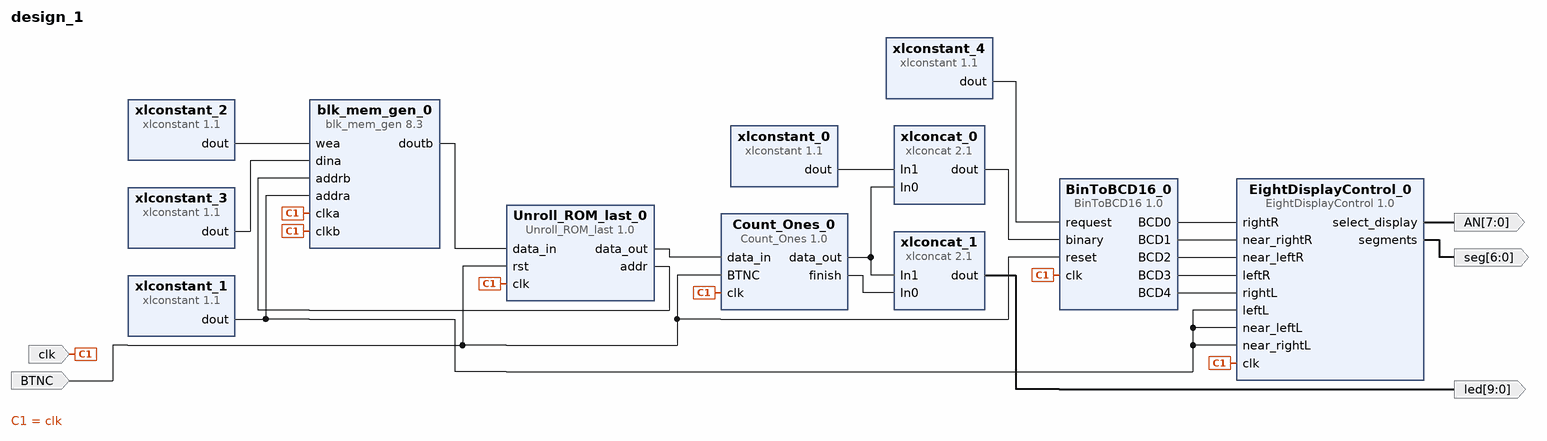
[diagram p0: block diagram of the top level]
# Vivado block design design_1, xc7a100tcsg324-1, Vivado 2016.4
create_bd_design design_1

create_bd_port -dir I clk
create_bd_port -dir O -from 7 -to 0 AN
create_bd_port -dir O -from 6 -to 0 seg
create_bd_port -dir I BTNC
create_bd_port -dir O -from 9 -to 0 led

create_bd_cell -type ip -vlnv xilinx.com:ip:blk_mem_gen:8.3 blk_mem_gen_0
set_property -dict [list \
  CONFIG.Memory_Type Simple_Dual_Port_RAM \
  CONFIG.Enable_32bit_Address false \
  CONFIG.Use_Byte_Write_Enable false \
  CONFIG.Write_Width_A 16 \
  CONFIG.Operating_Mode_A NO_CHANGE \
  CONFIG.Enable_A Always_Enabled \
  CONFIG.Write_Width_B 16 \
  CONFIG.Read_Width_B 16 \
  CONFIG.Enable_B Always_Enabled \
  CONFIG.Register_PortB_Output_of_Memory_Primitives false \
  CONFIG.Load_Init_File true \
  CONFIG.Coe_File 8ones.coe \
  CONFIG.Fill_Remaining_Memory_Locations false \
  CONFIG.Port_B_Clock 100 \
  CONFIG.Port_B_Enable_Rate 100 \
  CONFIG.use_bram_block Stand_Alone \
] [get_bd_cells blk_mem_gen_0]
create_bd_cell -type ip -vlnv user.org:user:BinToBCD16:1.0 BinToBCD16_0
create_bd_cell -type ip -vlnv xilinx.com:ip:xlconcat:2.1 xlconcat_0
set_property -dict {CONFIG.IN0_WIDTH 9 CONFIG.IN1_WIDTH 7} [get_bd_cells xlconcat_0]
create_bd_cell -type ip -vlnv xilinx.com:ip:xlconstant:1.1 xlconstant_0
set_property -dict {CONFIG.CONST_WIDTH 7 CONFIG.CONST_VAL 0} [get_bd_cells xlconstant_0]
create_bd_cell -type ip -vlnv user.org:user:EightDisplayControl:1.0 EightDisplayControl_0
create_bd_cell -type ip -vlnv xilinx.com:ip:xlconstant:1.1 xlconstant_1
set_property -dict {CONFIG.CONST_WIDTH 4 CONFIG.CONST_VAL 0} [get_bd_cells xlconstant_1]
create_bd_cell -type ip -vlnv xilinx.com:ip:xlconstant:1.1 xlconstant_2
set_property -dict {CONFIG.CONST_VAL 0} [get_bd_cells xlconstant_2]
create_bd_cell -type ip -vlnv xilinx.com:ip:xlconstant:1.1 xlconstant_3
set_property -dict {CONFIG.CONST_WIDTH 16 CONFIG.CONST_VAL 0} [get_bd_cells xlconstant_3]
create_bd_cell -type ip -vlnv xilinx.com:ip:xlconstant:1.1 xlconstant_4
create_bd_cell -type ip -vlnv user.org:user:Count_Ones:1.0 Count_Ones_0
set_property -dict {CONFIG.number_of_bits 256} [get_bd_cells Count_Ones_0]
create_bd_cell -type ip -vlnv xilinx.com:ip:xlconcat:2.1 xlconcat_1
set_property -dict {CONFIG.IN0_WIDTH 1 CONFIG.IN1_WIDTH 9} [get_bd_cells xlconcat_1]
create_bd_cell -type ip -vlnv user.org:user:Unroll_ROM_last:1.0 Unroll_ROM_last_0
set_property -dict {CONFIG.data_width 16} [get_bd_cells Unroll_ROM_last_0]

# ---- connections ----

connect_bd_net [get_bd_ports clk] \
  [get_bd_pins blk_mem_gen_0/clka] [get_bd_pins blk_mem_gen_0/clkb] [get_bd_pins BinToBCD16_0/clk] \
  [get_bd_pins EightDisplayControl_0/clk] [get_bd_pins Count_Ones_0/clk] [get_bd_pins Unroll_ROM_last_0/clk]
connect_bd_net [get_bd_pins Unroll_ROM_last_0/addr] [get_bd_pins blk_mem_gen_0/addrb]
connect_bd_net [get_bd_pins blk_mem_gen_0/doutb] [get_bd_pins Unroll_ROM_last_0/data_in]
connect_bd_net [get_bd_pins xlconstant_0/dout] [get_bd_pins xlconcat_0/In1]
connect_bd_net [get_bd_pins xlconcat_0/dout] [get_bd_pins BinToBCD16_0/binary]
connect_bd_net [get_bd_pins BinToBCD16_0/BCD0] [get_bd_pins EightDisplayControl_0/rightR]
connect_bd_net [get_bd_pins BinToBCD16_0/BCD1] [get_bd_pins EightDisplayControl_0/near_rightR]
connect_bd_net [get_bd_pins BinToBCD16_0/BCD2] [get_bd_pins EightDisplayControl_0/near_leftR]
connect_bd_net [get_bd_pins BinToBCD16_0/BCD3] [get_bd_pins EightDisplayControl_0/leftR]
connect_bd_net [get_bd_pins BinToBCD16_0/BCD4] [get_bd_pins EightDisplayControl_0/rightL]
connect_bd_net [get_bd_pins xlconstant_1/dout] \
  [get_bd_pins EightDisplayControl_0/near_rightL] [get_bd_pins EightDisplayControl_0/near_leftL] \
  [get_bd_pins EightDisplayControl_0/leftL] [get_bd_pins blk_mem_gen_0/addra]
connect_bd_net [get_bd_pins EightDisplayControl_0/select_display] [get_bd_ports AN]
connect_bd_net [get_bd_pins EightDisplayControl_0/segments] [get_bd_ports seg]
connect_bd_net [get_bd_pins xlconstant_2/dout] [get_bd_pins blk_mem_gen_0/wea]
connect_bd_net [get_bd_pins xlconstant_3/dout] [get_bd_pins blk_mem_gen_0/dina]
connect_bd_net [get_bd_pins xlconstant_4/dout] [get_bd_pins BinToBCD16_0/request]
connect_bd_net [get_bd_ports BTNC] [get_bd_pins BinToBCD16_0/reset] [get_bd_pins Count_Ones_0/BTNC] [get_bd_pins Unroll_ROM_last_0/rst]
connect_bd_net [get_bd_pins Unroll_ROM_last_0/data_out] [get_bd_pins Count_Ones_0/data_in]
connect_bd_net [get_bd_pins Count_Ones_0/data_out] [get_bd_pins xlconcat_1/In1] [get_bd_pins xlconcat_0/In0]
connect_bd_net [get_bd_pins Count_Ones_0/finish] [get_bd_pins xlconcat_1/In0]
connect_bd_net [get_bd_pins xlconcat_1/dout] [get_bd_ports led]

validate_bd_design
save_bd_design
